# EAGLE schematic flipchip (EAGLE 6.6.0)
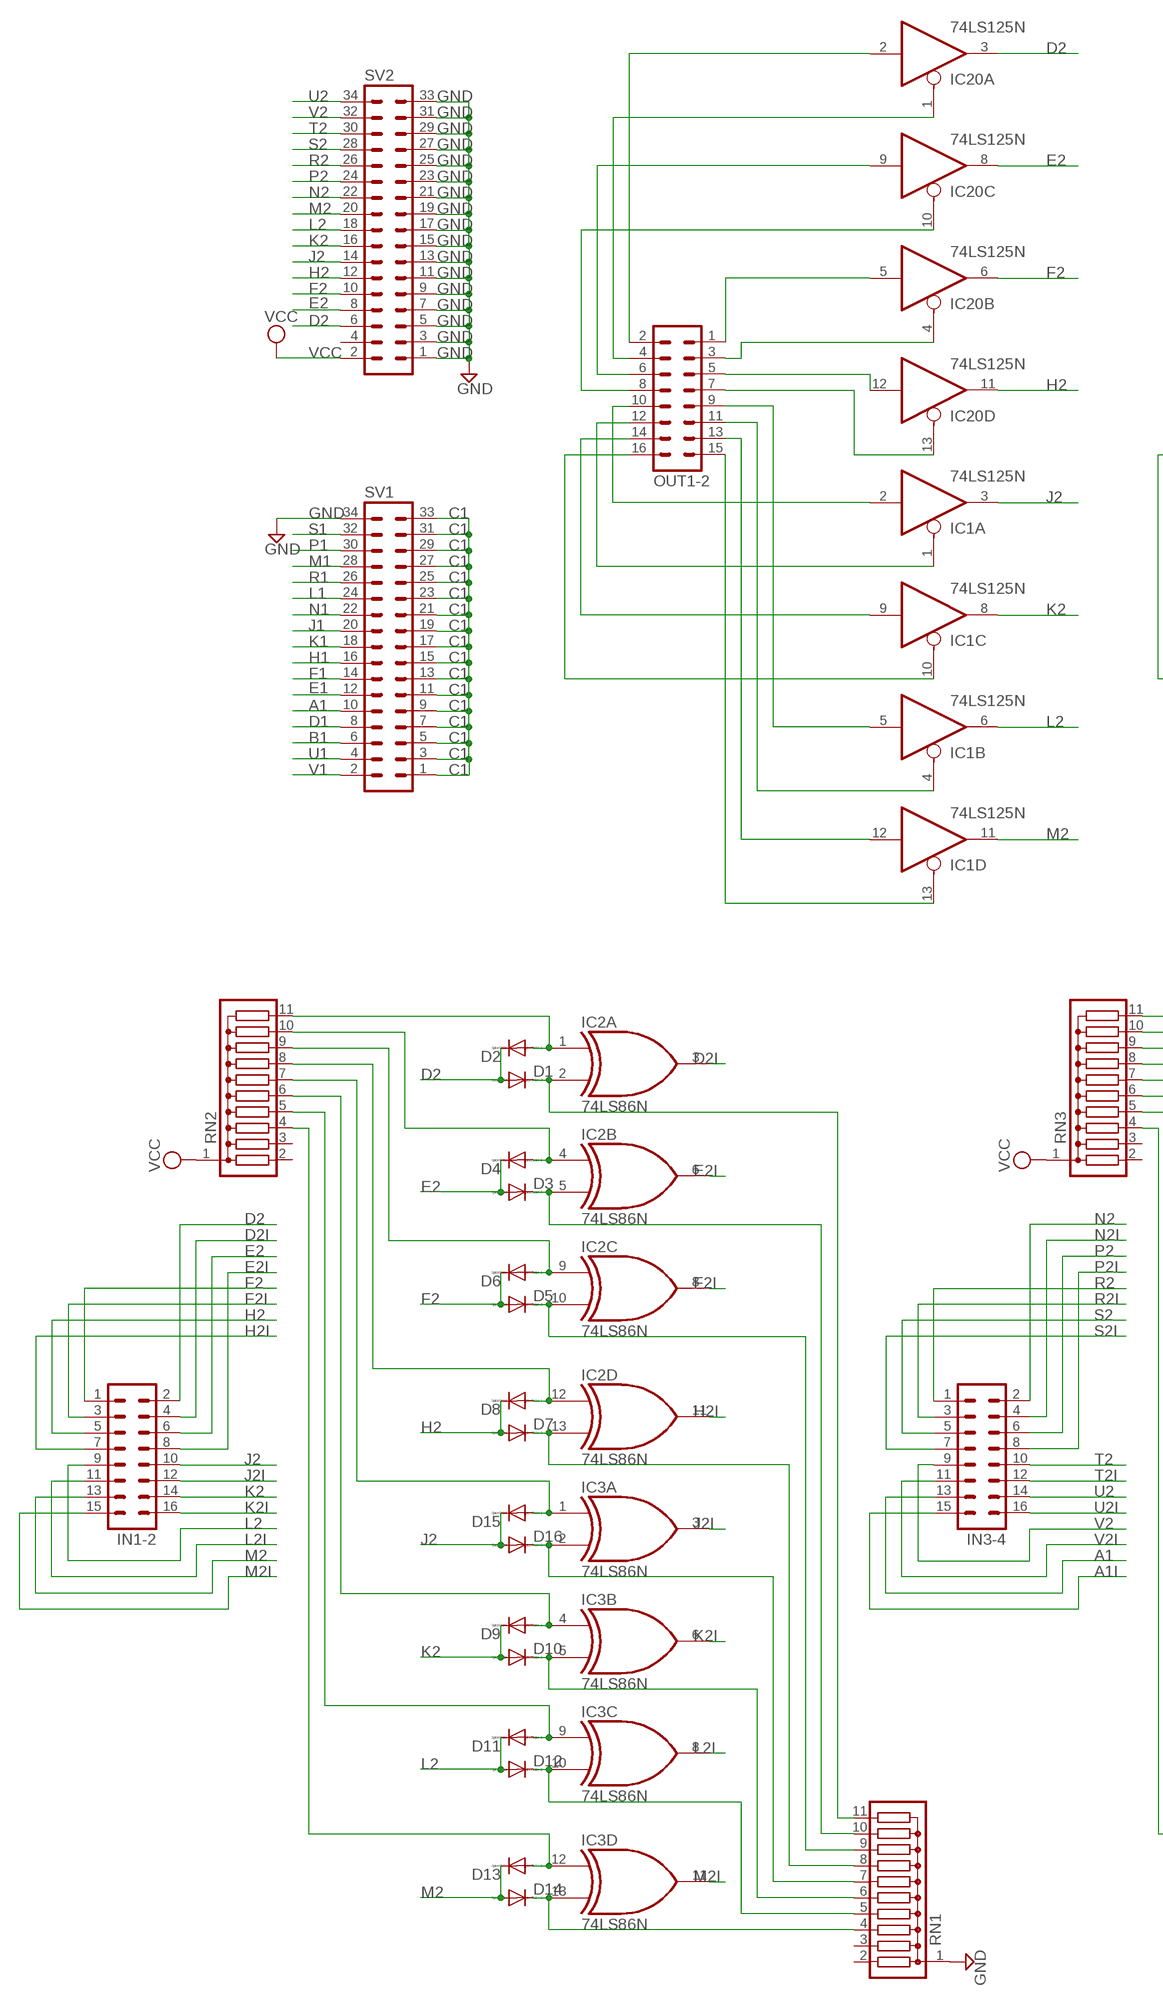
[diagram p0: schematic, sheet 1, part 1 of 2]
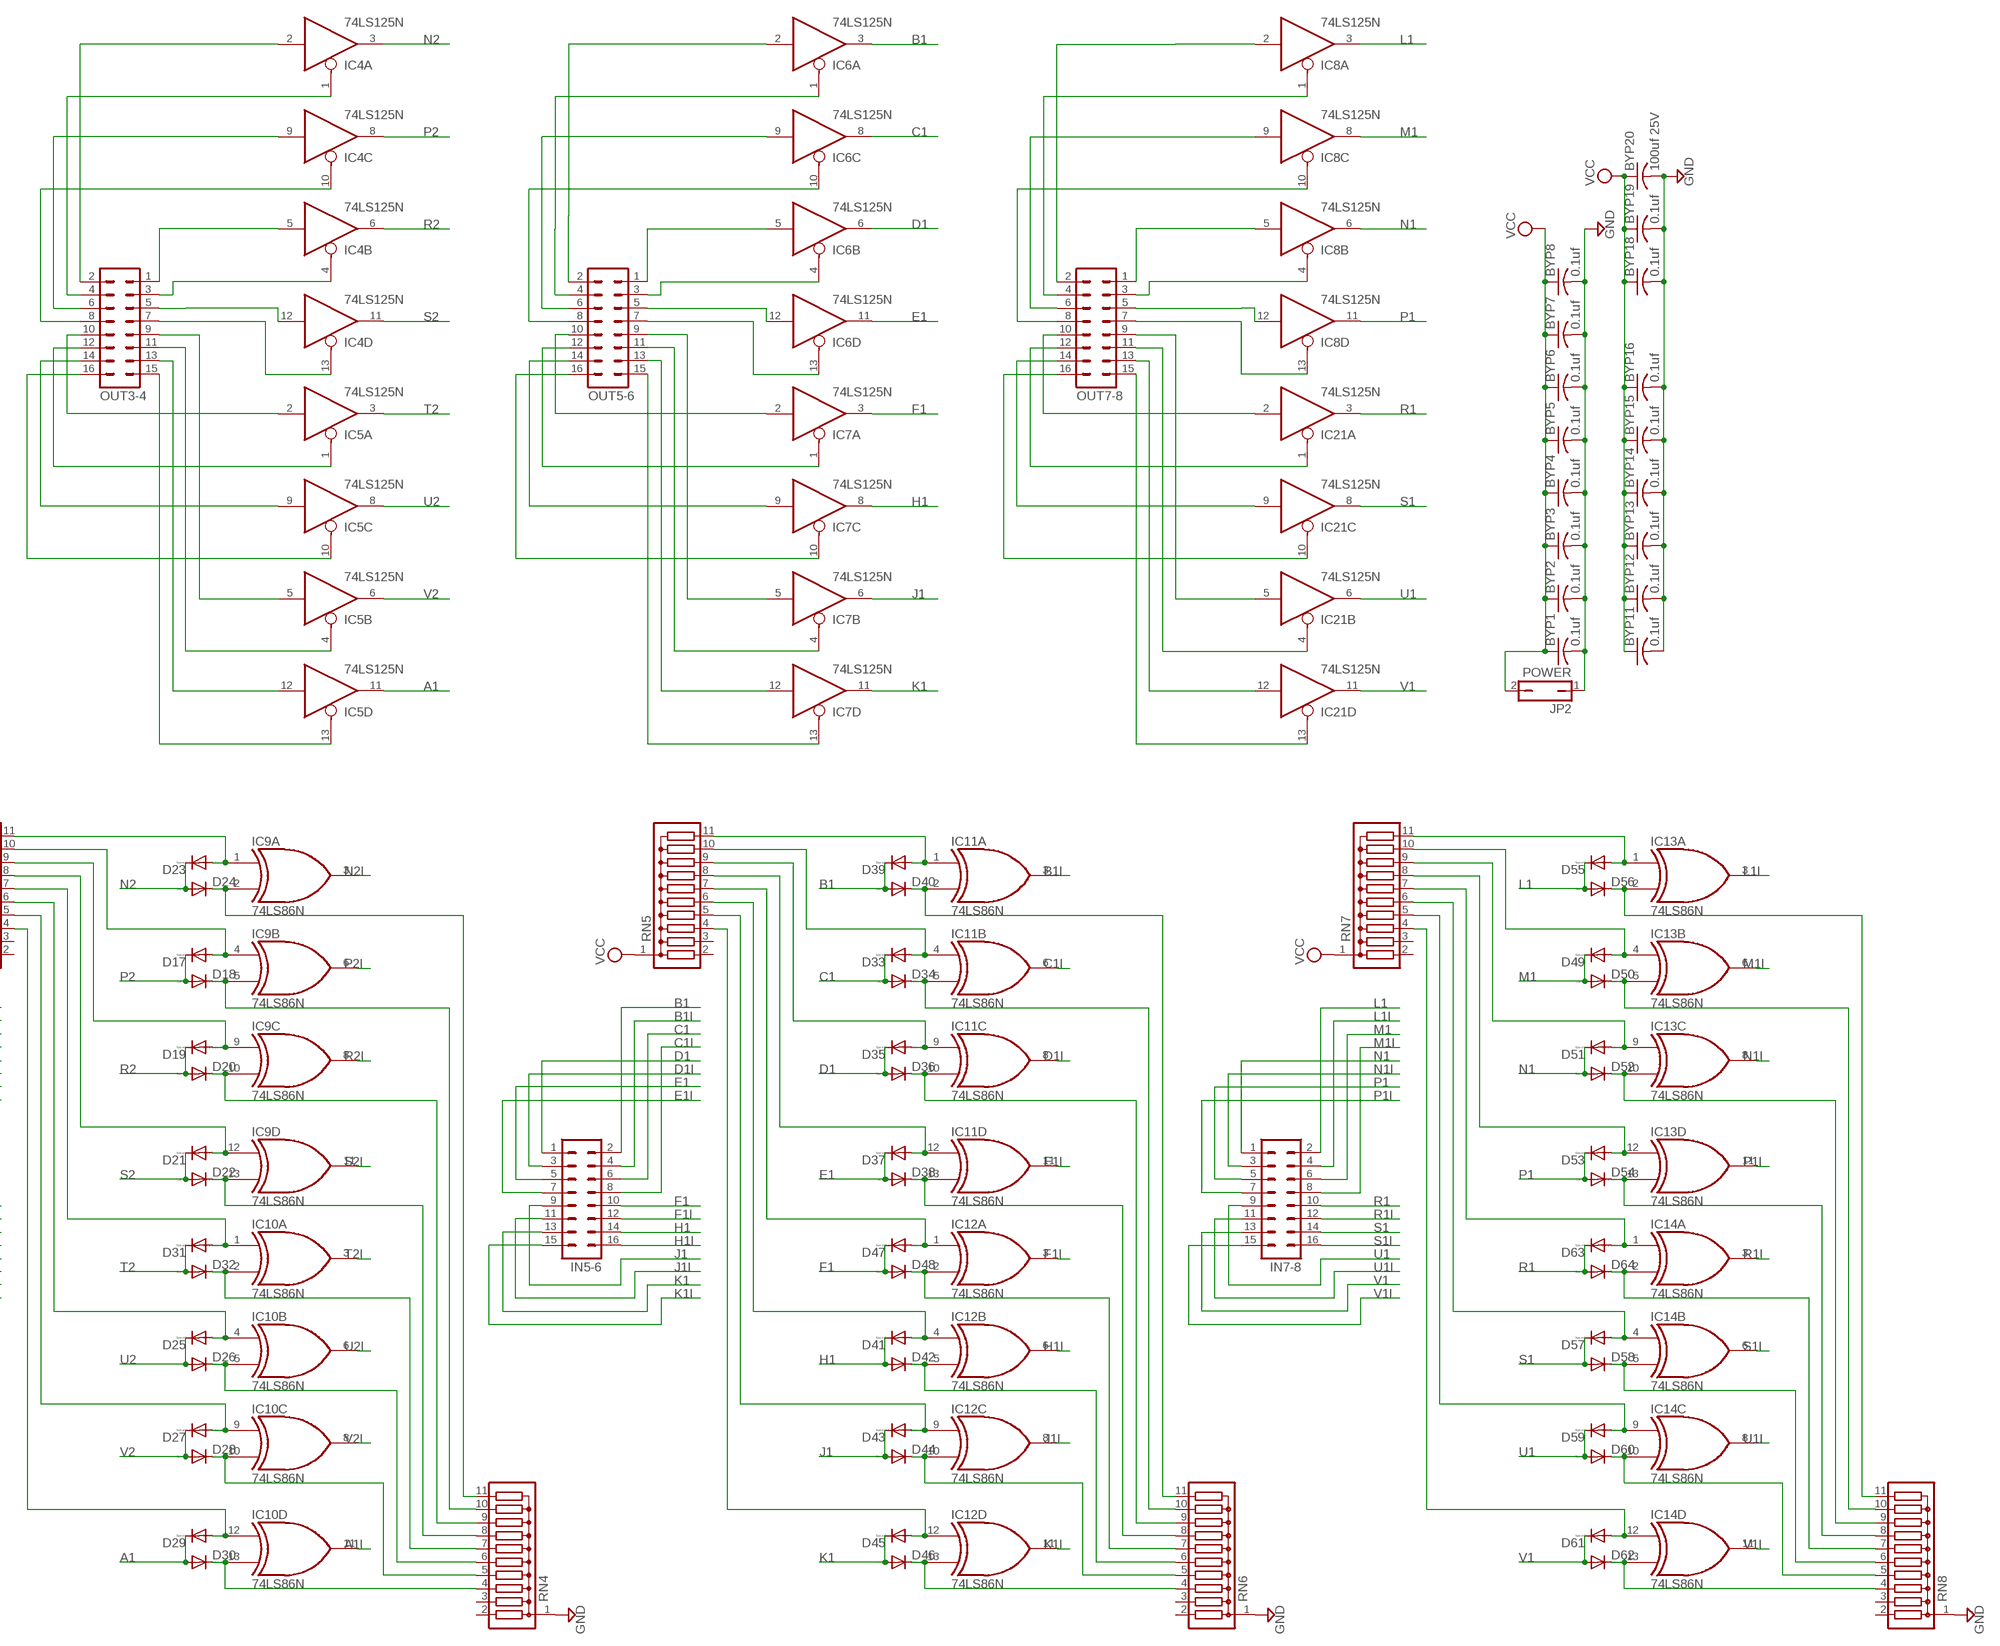
[diagram p1: schematic, sheet 1, part 2 of 2]

## Parts
BYP1  0.1uf  C-US050-025X075  [C050-025X075]
BYP2  0.1uf  C-US050-025X075  [C050-025X075]
BYP3  0.1uf  C-US050-025X075  [C050-025X075]
BYP4  0.1uf  C-US050-025X075  [C050-025X075]
BYP5  0.1uf  C-US050-025X075  [C050-025X075]
BYP6  0.1uf  C-US050-025X075  [C050-025X075]
BYP7  0.1uf  C-US050-025X075  [C050-025X075]
BYP8  0.1uf  C-US050-025X075  [C050-025X075]
BYP11  0.1uf  C-US050-025X075  [C050-025X075]
BYP12  0.1uf  C-US050-025X075  [C050-025X075]
BYP13  0.1uf  C-US050-025X075  [C050-025X075]
BYP14  0.1uf  C-US050-025X075  [C050-025X075]
BYP15  0.1uf  C-US050-025X075  [C050-025X075]
BYP16  0.1uf  C-US050-025X075  [C050-025X075]
BYP18  0.1uf  C-US050-025X075  [C050-025X075]
BYP19  0.1uf  C-US050-025X075  [C050-025X075]
BYP20  100uf 25V  C-US150-064X183  [C150-064X183]
D1  DIODE-D-2.5  [D-2.5]
D2  DIODE-D-2.5  [D-2.5]
D3  DIODE-D-2.5  [D-2.5]
D4  DIODE-D-2.5  [D-2.5]
D5  DIODE-D-2.5  [D-2.5]
D6  DIODE-D-2.5  [D-2.5]
D7  DIODE-D-2.5  [D-2.5]
D8  DIODE-D-2.5  [D-2.5]
D9  DIODE-D-2.5  [D-2.5]
D10  DIODE-D-2.5  [D-2.5]
D11  DIODE-D-2.5  [D-2.5]
D12  DIODE-D-2.5  [D-2.5]
D13  DIODE-D-2.5  [D-2.5]
D14  DIODE-D-2.5  [D-2.5]
D15  DIODE-D-2.5  [D-2.5]
D16  DIODE-D-2.5  [D-2.5]
D17  DIODE-D-2.5  [D-2.5]
D18  DIODE-D-2.5  [D-2.5]
D19  DIODE-D-2.5  [D-2.5]
D20  DIODE-D-2.5  [D-2.5]
D21  DIODE-D-2.5  [D-2.5]
D22  DIODE-D-2.5  [D-2.5]
D23  DIODE-D-2.5  [D-2.5]
D24  DIODE-D-2.5  [D-2.5]
D25  DIODE-D-2.5  [D-2.5]
D26  DIODE-D-2.5  [D-2.5]
D27  DIODE-D-2.5  [D-2.5]
D28  DIODE-D-2.5  [D-2.5]
D29  DIODE-D-2.5  [D-2.5]
D30  DIODE-D-2.5  [D-2.5]
D31  DIODE-D-2.5  [D-2.5]
D32  DIODE-D-2.5  [D-2.5]
D33  DIODE-D-2.5  [D-2.5]
D34  DIODE-D-2.5  [D-2.5]
D35  DIODE-D-2.5  [D-2.5]
D36  DIODE-D-2.5  [D-2.5]
D37  DIODE-D-2.5  [D-2.5]
D38  DIODE-D-2.5  [D-2.5]
D39  DIODE-D-2.5  [D-2.5]
D40  DIODE-D-2.5  [D-2.5]
D41  DIODE-D-2.5  [D-2.5]
D42  DIODE-D-2.5  [D-2.5]
D43  DIODE-D-2.5  [D-2.5]
D44  DIODE-D-2.5  [D-2.5]
D45  DIODE-D-2.5  [D-2.5]
D46  DIODE-D-2.5  [D-2.5]
D47  DIODE-D-2.5  [D-2.5]
D48  DIODE-D-2.5  [D-2.5]
D49  DIODE-D-2.5  [D-2.5]
D50  DIODE-D-2.5  [D-2.5]
D51  DIODE-D-2.5  [D-2.5]
D52  DIODE-D-2.5  [D-2.5]
D53  DIODE-D-2.5  [D-2.5]
D54  DIODE-D-2.5  [D-2.5]
D55  DIODE-D-2.5  [D-2.5]
D56  DIODE-D-2.5  [D-2.5]
D57  DIODE-D-2.5  [D-2.5]
D58  DIODE-D-2.5  [D-2.5]
D59  DIODE-D-2.5  [D-2.5]
D60  DIODE-D-2.5  [D-2.5]
D61  DIODE-D-2.5  [D-2.5]
D62  DIODE-D-2.5  [D-2.5]
D63  DIODE-D-2.5  [D-2.5]
D64  DIODE-D-2.5  [D-2.5]
IC1  74LS125N  [DIL14]
IC2  74LS86N  [DIL14]
IC3  74LS86N  [DIL14]
IC4  74LS125N  [DIL14]
IC5  74LS125N  [DIL14]
IC6  74LS125N  [DIL14]
IC7  74LS125N  [DIL14]
IC8  74LS125N  [DIL14]
IC9  74LS86N  [DIL14]
IC10  74LS86N  [DIL14]
IC11  74LS86N  [DIL14]
IC12  74LS86N  [DIL14]
IC13  74LS86N  [DIL14]
IC14  74LS86N  [DIL14]
IC20  74LS125N  [DIL14]
IC21  74LS125N  [DIL14]
IN1-2  MA08-2  [MA08-2]
IN3-4  MA08-2  [MA08-2]
IN5-6  MA08-2  [MA08-2]
IN7-8  MA08-2  [MA08-2]
JP2  POWER  JP1Q  [JP1]
OUT1-2  MA08-2  [MA08-2]
OUT3-4  MA08-2  [MA08-2]
OUT5-6  MA08-2  [MA08-2]
OUT7-8  MA08-2  [MA08-2]
RN1  G10R  [SIL11]
RN2  G10R  [SIL11]
RN3  G10R  [SIL11]
RN4  G10R  [SIL11]
RN5  G10R  [SIL11]
RN6  G10R  [SIL11]
RN7  G10R  [SIL11]
RN8  G10R  [SIL11]
SV1  MA17-2  [MA17-2]
SV2  MA17-2  [MA17-2]

## Nets
A1: D29.C D30.A IC5.11(D:O) IN3-4.13 SV1.10
A1I: IC10.11(D:O) IN3-4.15
B1: D39.C D40.A IC6.3(A:O) IN5-6.2 SV1.6
B1I: IC11.3(A:O) IN5-6.4
C1: D33.C D34.A IC6.8(C:O) IN5-6.6 SV1.1 SV1.3 SV1.5 SV1.7 SV1.9 SV1.11 SV1.13 SV1.15 SV1.17 SV1.19 SV1.21 SV1.23 SV1.25 SV1.27 SV1.29 SV1.31 SV1.33
C1I: IC11.6(B:O) IN5-6.8
D1: D35.C D36.A IC6.6(B:O) IN5-6.1 SV1.8
D1I: IC11.8(C:O) IN5-6.3
D2: D1.A D2.C IC20.3(A:O) IN1-2.2 SV2.6
D2I: IC2.3(A:O) IN1-2.4
E1: D37.C D38.A IC6.11(D:O) IN5-6.5 SV1.12
E1I: IC11.11(D:O) IN5-6.7
E2: D3.A D4.C IC20.8(C:O) IN1-2.6 SV2.8
E2I: IC2.6(B:O) IN1-2.8
F1: D47.C D48.A IC7.3(A:O) IN5-6.10 SV1.14
F1I: IC12.3(A:O) IN5-6.12
F2: D5.A D6.C IC20.6(B:O) IN1-2.1 SV2.10
F2I: IC2.8(C:O) IN1-2.3
GND [Power]: BYP1.2 BYP2.2 BYP3.2 BYP4.2 BYP5.2 BYP6.2 BYP7.2 BYP8.2 BYP11.2 BYP12.2 BYP13.2 BYP14.2 BYP15.2 BYP16.2 BYP18.2 BYP19.2 BYP20.2 JP2.1 RN1.1 RN4.1 RN6.1 RN8.1 SV1.34 SV2.1 SV2.3 SV2.5 SV2.7 SV2.9 SV2.11 SV2.13 SV2.15 SV2.17 SV2.19 SV2.21 SV2.23 SV2.25 SV2.27 SV2.29 SV2.31 SV2.33
H1: D41.C D42.A IC7.8(C:O) IN5-6.14 SV1.16
H1I: IC12.6(B:O) IN5-6.16
H2: D7.A D8.C IC20.11(D:O) IN1-2.5 SV2.12
H2I: IC2.11(D:O) IN1-2.7
J1: D43.C D44.A IC7.6(B:O) IN5-6.9 SV1.20
J1I: IC12.8(C:O) IN5-6.11
J2: D15.C D16.A IC1.3(A:O) IN1-2.10 SV2.14
J2I: IC3.3(A:O) IN1-2.12
K1: D45.C D46.A IC7.11(D:O) IN5-6.13 SV1.18
K1I: IC12.11(D:O) IN5-6.15
K2: D9.C D10.A IC1.8(C:O) IN1-2.14 SV2.16
K2I: IC3.6(B:O) IN1-2.16
L1: D55.C D56.A IC8.3(A:O) IN7-8.2 SV1.24
L1I: IC13.3(A:O) IN7-8.4
L2: D11.C D12.A IC1.6(B:O) IN1-2.9 SV2.18
L2I: IC3.8(C:O) IN1-2.11
M1: D49.C D50.A IC8.8(C:O) IN7-8.6 SV1.28
M1I: IC13.6(B:O) IN7-8.8
M2: D13.C D14.A IC1.11(D:O) IN1-2.13 SV2.20
M2I: IC3.11(D:O) IN1-2.15
N1: D51.C D52.A IC8.6(B:O) IN7-8.1 SV1.22
N1I: IC13.8(C:O) IN7-8.3
N2: D23.C D24.A IC4.3(A:O) IN3-4.2 SV2.22
N2I: IC9.3(A:O) IN3-4.4
N$1: D24.C IC9.2(A:I1) RN4.11
N$2: D23.A IC9.1(A:I0) RN3.11
N$3: D1.C IC2.2(A:I1) RN1.11
N$4: D2.A IC2.1(A:I0) RN2.11
N$5: D18.C IC9.5(B:I1) RN4.10
N$6: D3.C IC2.5(B:I1) RN1.10
N$7: D17.A IC9.4(B:I0) RN3.10
N$8: D19.A IC9.9(C:I0) RN3.9
N$9: D21.A IC9.12(D:I0) RN3.8
N$10: D31.A IC10.1(A:I0) RN3.7
N$11: D25.A IC10.4(B:I0) RN3.6
N$12: D27.A IC10.9(C:I0) RN3.5
N$13: D29.A IC10.12(D:I0) RN3.4
N$14: D28.C IC10.10(C:I1) RN4.5
N$15: D20.C IC9.10(C:I1) RN4.9
N$16: D22.C IC9.13(D:I1) RN4.8
N$17: D32.C IC10.2(A:I1) RN4.7
N$18: D26.C IC10.5(B:I1) RN4.6
N$19: D30.C IC10.13(D:I1) RN4.4
N$20: D40.C IC11.2(A:I1) RN6.11
N$21: D4.A IC2.4(B:I0) RN2.10
N$22: D39.A IC11.1(A:I0) RN5.11
N$23: D5.C IC2.10(C:I1) RN1.9
N$24: D6.A IC2.9(C:I0) RN2.9
N$25: D34.C IC11.5(B:I1) RN6.10
N$26: IC6.2(A:I) OUT5-6.2
N$33: IC4.5(B:I) OUT3-4.1
N$34: IC4.4(B:OE) OUT3-4.3
N$35: IC4.12(D:I) OUT3-4.5
N$36: IC4.13(D:OE) OUT3-4.7
N$49: IC4.1(A:OE) OUT3-4.4
N$50: IC4.9(C:I) OUT3-4.6
N$51: IC4.2(A:I) OUT3-4.2
N$52: IC4.10(C:OE) OUT3-4.8
N$53: IC20.5(B:I) OUT1-2.1
N$54: IC20.4(B:OE) OUT1-2.3
N$55: IC20.12(D:I) OUT1-2.5
N$56: IC20.13(D:OE) OUT1-2.7
N$57: IC20.2(A:I) OUT1-2.2
N$58: IC20.1(A:OE) OUT1-2.4
N$59: IC20.9(C:I) OUT1-2.6
N$60: IC20.10(C:OE) OUT1-2.8
N$61: IC1.13(D:OE) OUT1-2.15
N$62: IC1.12(D:I) OUT1-2.13
N$63: IC1.4(B:OE) OUT1-2.11
N$64: IC1.5(B:I) OUT1-2.9
N$65: IC1.2(A:I) OUT1-2.10
N$66: IC1.1(A:OE) OUT1-2.12
N$67: IC1.9(C:I) OUT1-2.14
N$68: IC1.10(C:OE) OUT1-2.16
N$69: IC5.2(A:I) OUT3-4.10
N$70: IC5.1(A:OE) OUT3-4.12
N$71: IC5.9(C:I) OUT3-4.14
N$72: IC5.10(C:OE) OUT3-4.16
N$73: IC5.13(D:OE) OUT3-4.15
N$74: IC5.12(D:I) OUT3-4.13
N$75: IC5.4(B:OE) OUT3-4.11
N$76: IC5.5(B:I) OUT3-4.9
N$81: IC6.5(B:I) OUT5-6.1
N$82: IC6.4(B:OE) OUT5-6.3
N$83: IC6.12(D:I) OUT5-6.5
N$84: IC6.13(D:OE) OUT5-6.7
N$85: IC8.5(B:I) OUT7-8.1
N$86: IC8.4(B:OE) OUT7-8.3
N$87: IC8.12(D:I) OUT7-8.5
N$88: IC8.13(D:OE) OUT7-8.7
N$89: IC6.1(A:OE) OUT5-6.4
N$90: IC6.9(C:I) OUT5-6.6
N$91: IC6.10(C:OE) OUT5-6.8
N$92: IC7.5(B:I) OUT5-6.9
N$93: IC7.4(B:OE) OUT5-6.11
N$95: IC7.12(D:I) OUT5-6.13
N$96: IC7.13(D:OE) OUT5-6.15
N$97: IC7.2(A:I) OUT5-6.10
N$98: IC7.1(A:OE) OUT5-6.12
N$99: IC7.9(C:I) OUT5-6.14
N$100: IC7.10(C:OE) OUT5-6.16
N$113: IC21.13(D:OE) OUT7-8.15
N$114: IC21.12(D:I) OUT7-8.13
N$115: IC21.4(B:OE) OUT7-8.11
N$116: IC21.5(B:I) OUT7-8.9
N$117: IC21.2(A:I) OUT7-8.10
N$118: IC21.1(A:OE) OUT7-8.12
N$119: IC21.9(C:I) OUT7-8.14
N$120: IC21.10(C:OE) OUT7-8.16
N$121: IC8.10(C:OE) OUT7-8.8
N$122: IC8.9(C:I) OUT7-8.6
N$123: IC8.1(A:OE) OUT7-8.4
N$137: IC8.2(A:I) OUT7-8.2
N$138: D7.C IC2.13(D:I1) RN1.8
N$139: D8.A IC2.12(D:I0) RN2.8
N$140: D33.A IC11.4(B:I0) RN5.10
N$141: D16.C IC3.2(A:I1) RN1.7
N$142: D15.A IC3.1(A:I0) RN2.7
N$143: D35.A IC11.9(C:I0) RN5.9
N$144: D10.C IC3.5(B:I1) RN1.6
N$145: D9.A IC3.4(B:I0) RN2.6
N$146: D37.A IC11.12(D:I0) RN5.8
N$147: D12.C IC3.10(C:I1) RN1.5
N$148: D11.A IC3.9(C:I0) RN2.5
N$149: D47.A IC12.1(A:I0) RN5.7
N$150: D14.C IC3.13(D:I1) RN1.4
N$151: D13.A IC3.12(D:I0) RN2.4
N$152: D41.A IC12.4(B:I0) RN5.6
N$153: D43.A IC12.9(C:I0) RN5.5
N$154: D45.A IC12.12(D:I0) RN5.4
N$155: D44.C IC12.10(C:I1) RN6.5
N$156: D36.C IC11.10(C:I1) RN6.9
N$157: D38.C IC11.13(D:I1) RN6.8
N$158: D48.C IC12.2(A:I1) RN6.7
N$159: D42.C IC12.5(B:I1) RN6.6
N$160: D46.C IC12.13(D:I1) RN6.4
N$161: D56.C IC13.2(A:I1) RN8.11
N$162: D55.A IC13.1(A:I0) RN7.11
N$163: D50.C IC13.5(B:I1) RN8.10
N$164: D49.A IC13.4(B:I0) RN7.10
N$165: D51.A IC13.9(C:I0) RN7.9
N$166: D53.A IC13.12(D:I0) RN7.8
N$167: D63.A IC14.1(A:I0) RN7.7
N$168: D57.A IC14.4(B:I0) RN7.6
N$169: D59.A IC14.9(C:I0) RN7.5
N$170: D61.A IC14.12(D:I0) RN7.4
N$171: D60.C IC14.10(C:I1) RN8.5
N$172: D52.C IC13.10(C:I1) RN8.9
N$173: D54.C IC13.13(D:I1) RN8.8
N$174: D64.C IC14.2(A:I1) RN8.7
N$175: D58.C IC14.5(B:I1) RN8.6
N$176: D62.C IC14.13(D:I1) RN8.4
P1: D53.C D54.A IC8.11(D:O) IN7-8.5 SV1.30
P1I: IC13.11(D:O) IN7-8.7
P2: D17.C D18.A IC4.8(C:O) IN3-4.6 SV2.24
P2I: IC9.6(B:O) IN3-4.8
R1: D63.C D64.A IC21.3(A:O) IN7-8.10 SV1.26
R1I: IC14.3(A:O) IN7-8.12
R2: D19.C D20.A IC4.6(B:O) IN3-4.1 SV2.26
R2I: IC9.8(C:O) IN3-4.3
S1: D57.C D58.A IC21.8(C:O) IN7-8.14 SV1.32
S1I: IC14.6(B:O) IN7-8.16
S2: D21.C D22.A IC4.11(D:O) IN3-4.5 SV2.28
S2I: IC9.11(D:O) IN3-4.7
T2: D31.C D32.A IC5.3(A:O) IN3-4.10 SV2.30
T2I: IC10.3(A:O) IN3-4.12
U1: D59.C D60.A IC21.6(B:O) IN7-8.9 SV1.4
U1I: IC14.8(C:O) IN7-8.11
U2: D25.C D26.A IC5.8(C:O) IN3-4.14 SV2.34
U2I: IC10.6(B:O) IN3-4.16
V1: D61.C D62.A IC21.11(D:O) IN7-8.13 SV1.2
V1I: IC14.11(D:O) IN7-8.15
V2: D27.C D28.A IC5.6(B:O) IN3-4.9 SV2.32
V2I: IC10.8(C:O) IN3-4.11
VCC [Power]: BYP1.1 BYP2.1 BYP3.1 BYP4.1 BYP5.1 BYP6.1 BYP7.1 BYP8.1 BYP11.1 BYP12.1 BYP13.1 BYP14.1 BYP15.1 BYP16.1 BYP18.1 BYP19.1 BYP20.1 JP2.2 RN2.1 RN3.1 RN5.1 RN7.1 SV2.2
Unconnected: RN1.2 RN1.3 RN2.2 RN2.3 RN3.2 RN3.3 RN4.2 RN4.3 RN5.2 RN5.3 RN6.2 RN6.3 RN7.2 RN7.3 RN8.2 RN8.3 SV2.4

## Power pins joined to a net without a drawn wire
GND: IC1.7(P:GND) IC2.7(P:GND) IC3.7(P:GND) IC4.7(P:GND) IC5.7(P:GND) IC6.7(P:GND) IC7.7(P:GND) IC8.7(P:GND) IC9.7(P:GND) IC10.7(P:GND) IC11.7(P:GND) IC12.7(P:GND) IC13.7(P:GND) IC14.7(P:GND) IC20.7(P:GND) IC21.7(P:GND)
VCC: IC1.14(P:VCC) IC2.14(P:VCC) IC3.14(P:VCC) IC4.14(P:VCC) IC5.14(P:VCC) IC6.14(P:VCC) IC7.14(P:VCC) IC8.14(P:VCC) IC9.14(P:VCC) IC10.14(P:VCC) IC11.14(P:VCC) IC12.14(P:VCC) IC13.14(P:VCC) IC14.14(P:VCC) IC20.14(P:VCC) IC21.14(P:VCC)

## Library data of the parts
BYP1-BYP8 BYP11-BYP16 BYP18-BYP20 = rcl:C-US: CAPACITOR, American symbol
D1-D64 = diode:DIODE-: DIODE
IC1 IC4-IC8 IC20 IC21 = 74xx-us:74*125: Quad bus BUFFER, 3-state
IC2 IC3 IC9-IC14 = 74xx-us:74*86: Quad 2-input EXCLUSIV-OR (XOR) gate
IN1-2 IN3-4 IN5-6 IN7-8 OUT1-2 OUT3-4 OUT5-6 OUT7-8 = con-lstb:MA08-2: PIN HEADER; OC_FARNELL: unknown; OC_NEWARK: unknown
JP2 = jumper:JP1Q: JUMPER
RN1-RN8 = resistor-sil:G10R: SIL RESISTOR; OC_FARNELL: unknown; OC_NEWARK: unknown
SV1 SV2 = con-lstb:MA17-2: PIN HEADER; OC_FARNELL: unknown; OC_NEWARK: unknown

## Net classes
1 Power: width 0.508 mm, drill 0.254 mm, clearance 0.254 mm